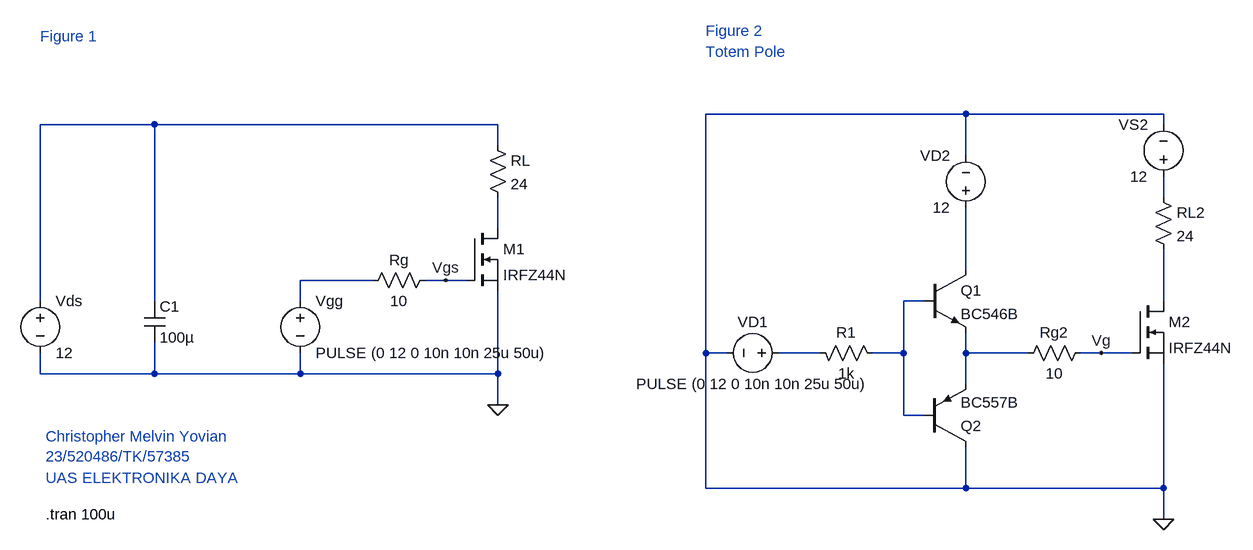
[diagram p0: schematic UAS Elday Task 1_520486.asc]
UAS Elday Task 1_520486.asc, the LTspice schematic file:
Version 4
SHEET 1 2160 680
WIRE 1392 -144 992 -144
WIRE 1696 -144 1392 -144
WIRE 144 -128 -32 -128
WIRE 672 -128 144 -128
WIRE 1696 -128 1696 -144
WIRE 672 -96 672 -128
WIRE 1392 -80 1392 -144
WIRE 1696 -16 1696 -48
WIRE 672 32 672 -16
WIRE 1392 96 1392 0
WIRE 480 112 368 112
WIRE 592 112 560 112
WIRE 624 112 592 112
WIRE -32 144 -32 -128
WIRE 144 144 144 -128
WIRE 368 144 368 112
WIRE 1328 144 1296 144
WIRE 1696 144 1696 64
WIRE 992 224 992 -144
WIRE 1024 224 992 224
WIRE 1168 224 1104 224
WIRE 1296 224 1296 144
WIRE 1296 224 1248 224
WIRE 1392 224 1392 192
WIRE 1488 224 1392 224
WIRE 1600 224 1568 224
WIRE 1648 224 1600 224
WIRE -32 256 -32 224
WIRE 144 256 144 208
WIRE 144 256 -32 256
WIRE 368 256 368 224
WIRE 368 256 144 256
WIRE 672 256 672 128
WIRE 672 256 368 256
WIRE 1392 272 1392 224
WIRE 672 304 672 256
WIRE 1296 320 1296 224
WIRE 1328 320 1296 320
WIRE 992 432 992 224
WIRE 1392 432 1392 368
WIRE 1392 432 992 432
WIRE 1696 432 1696 240
WIRE 1696 432 1392 432
WIRE 1696 480 1696 432
FLAG 672 304 0
FLAG 1696 480 0
FLAG 592 112 Vgs
FLAG 1600 224 Vg
SYMBOL voltage -32 128 R0
SYMATTR InstName Vds
SYMATTR Value 12
SYMBOL cap 128 144 R0
SYMATTR InstName C1
SYMATTR Value 100µ
SYMBOL voltage 368 128 R0
SYMATTR InstName Vgg
SYMATTR Value PULSE (0 12 0 10n 10n 25u 50u)
SYMBOL res 576 96 R90
WINDOW 0 0 56 VBottom 2
WINDOW 3 32 56 VTop 2
SYMATTR InstName Rg
SYMATTR Value 10
SYMBOL nmos 624 32 R0
SYMATTR InstName M1
SYMATTR Value IRFZ44N
SYMBOL res 656 -112 R0
SYMATTR InstName RL
SYMATTR Value 24
SYMBOL nmos 1648 144 R0
SYMATTR InstName M2
SYMATTR Value IRFZ44N
SYMBOL voltage 1120 224 R90
WINDOW 0 -32 56 VBottom 2
WINDOW 3 32 56 VTop 2
SYMATTR InstName VD1
SYMATTR Value PULSE (0 12 0 10n 10n 25u 50u)
SYMBOL res 1152 208 M90
WINDOW 0 0 56 VBottom 2
WINDOW 3 32 56 VTop 2
SYMATTR InstName R1
SYMATTR Value 1k
SYMBOL npn 1328 96 R0
SYMATTR InstName Q1
SYMATTR Value BC546B
SYMBOL pnp 1328 368 M180
SYMATTR InstName Q2
SYMATTR Value BC557B
SYMBOL res 1680 -32 R0
SYMATTR InstName RL2
SYMATTR Value 24
SYMBOL voltage 1696 -32 R180
WINDOW 0 24 96 Left 2
WINDOW 3 24 16 Left 2
SYMATTR InstName VS2
SYMATTR Value 12
SYMBOL voltage 1392 16 R180
WINDOW 0 24 96 Left 2
WINDOW 3 24 16 Left 2
SYMATTR InstName VD2
SYMATTR Value 12
SYMBOL res 1584 208 R90
WINDOW 0 0 56 VBottom 2
WINDOW 3 32 56 VTop 2
SYMATTR InstName Rg2
SYMATTR Value 10
TEXT -24 472 Left 2 !.tran 100u
TEXT 992 -240 Left 2 ;Totem Pole
TEXT -32 -264 Left 2 ;Figure 1
TEXT 992 -272 Left 2 ;Figure 2
TEXT -24 352 Left 2 ;Christopher Melvin Yovian\n23/520486/TK/57385
TEXT -24 416 Left 2 ;UAS ELEKTRONIKA DAYA

The netlist it stands for:
* UAS Elday Task 1_520486.asc
Vds N001 0 12
C1 N001 0 100µ
Vgg N005 0 PULSE (0 12 0 10n 10n 25u 50u)
Rg Vgs N005 10
M1 N003 Vgs 0 0 IRFZ44N
RL N001 N003 24
M2 N007 Vg 0 0 IRFZ44N
VD1 N008 0 PULSE (0 12 0 10n 10n 25u 50u)
R1 N008 N006 1k
Q1 N004 N006 N009 0 BC546B
Q2 0 N006 N009 0 BC557B
RL2 N002 N007 24
VS2 N002 0 12
VD2 N004 0 12
Rg2 Vg N009 10
.model NPN NPN
.model PNP PNP
.lib standard.bjt
.model NMOS NMOS
.model PMOS PMOS
.lib standard.mos
.tran 100u
* Totem Pole
* Figure 1
* Figure 2
* Christopher Melvin Yovian
* 23/520486/TK/57385
* UAS ELEKTRONIKA DAYA
.backanno
.end